# EAGLE design CanBus20mar (EAGLE 7.6.0)
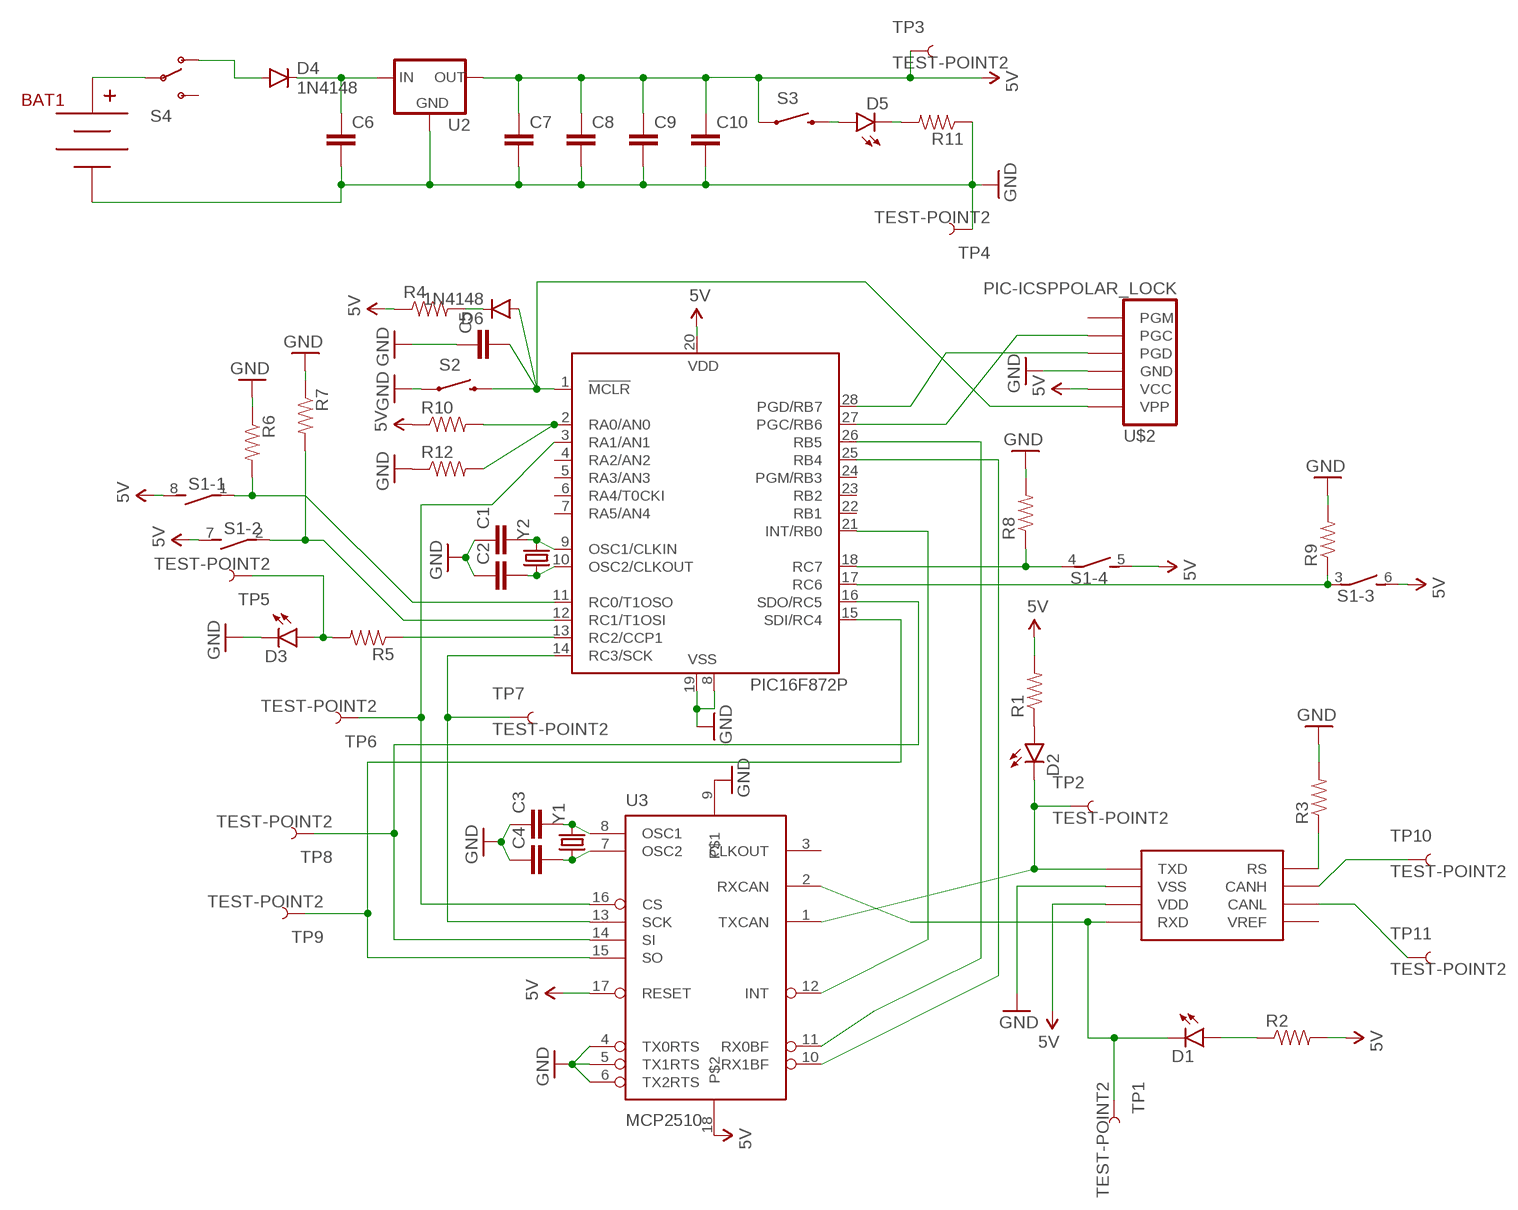
[diagram p0: schematic, sheet 1]

## Parts
BAT1  BC9VPC  [BC9VPC]
C1  CAPPTH  [CAP-PTH-SMALL]
C2  CAPPTH  [CAP-PTH-SMALL]
C3  CAPPTH  [CAP-PTH-SMALL]
C4  CAPPTH  [CAP-PTH-SMALL]
C5  CAPPTH  [CAP-PTH-SMALL]
C6  CAPPTH  [CAP-PTH-SMALL]
C7  CAPPTH  [CAP-PTH-SMALL]
C8  CAPPTH  [CAP-PTH-SMALL]
C9  CAPPTH  [CAP-PTH-SMALL]
C10  CAPPTH  [CAP-PTH-SMALL]
D1  LED5MM  [LED5MM]
D2  LED5MM  [LED5MM]
D3  LED5MM  [LED5MM]
D4  1N4148  DIODEKIT  [DIODE-1N4148-KIT]
D5  LED5MM  [LED5MM]
D6  1N4148  DIODEKIT  [DIODE-1N4148-KIT]
IC1  PIC16F872P  [DIL28-3]
R1  RESISTOREZ  [AXIAL-0.3EZ]
R2  RESISTOREZ  [AXIAL-0.3EZ]
R3  RESISTOREZ  [AXIAL-0.3EZ]
R4  RESISTOREZ  [AXIAL-0.3EZ]
R5  RESISTOREZ  [AXIAL-0.3EZ]
R6  RESISTOREZ  [AXIAL-0.3EZ]
R7  RESISTOREZ  [AXIAL-0.3EZ]
R8  RESISTOREZ  [AXIAL-0.3EZ]
R9  RESISTOREZ  [AXIAL-0.3EZ]
R10  RESISTOREZ  [AXIAL-0.3EZ]
R11  RESISTOREZ  [AXIAL-0.3EZ]
R12  RESISTORAXIAL-0.3  [AXIAL-0.3]
S1  DIP04S  [DIP04S]
S2  SWITCH-MOMENTARY-2PTH  [TACTILE-PTH]
S3  SWITCH-MOMENTARY-2PTH  [TACTILE-PTH]
S4  SWITCH-SPDTSMD2  [SWITCH-SPDT-SMD]
TP1  TEST-POINT2  [PAD.02X.02]
TP2  TEST-POINT2  [PAD.02X.02]
TP3  TEST-POINT2  [PAD.02X.02]
TP4  TEST-POINT2  [PAD.02X.02]
TP5  TEST-POINT2  [PAD.02X.02]
TP6  TEST-POINT2  [PAD.02X.02]
TP7  TEST-POINT2  [PAD.02X.02]
TP8  TEST-POINT2  [PAD.02X.02]
TP9  TEST-POINT2  [PAD.02X.02]
TP10  TEST-POINT2  [PAD.02X.02]
TP11  TEST-POINT2  [PAD.02X.02]
U2  V_REG_78XXSIDE  [78XXL]
U3  MCP2510  [DIL18]
U$1  MCP2551  [MCP2551]
U$2  PIC-ICSPPOLAR_LOCK  [MOLEX-1X6_LOCK]
Y1  CRYSTALHC49UV  [HC49U-V]
Y2  CRYSTALHC49UV  [HC49U-V]

## Nets
5V: C7.1 C8.1 C9.1 C10.1 IC1.20(VDD) R1.P$2 R2.P$2 R4.P$1 R10.P$1 S1.5 S1.6 S1.7 S1.8 S3.1 TP3.P$1 U2.OUT U3.17(RESET) U3.18 U$1.VDD U$2.5(VCC)
GND: BAT1.V- C1.1 C2.1 C3.1 C4.1 C5.1 C6.2 C7.2 C8.2 C9.2 C10.2 D3.K(C) IC1.8(VSS) IC1.19(VSS) R3.P$2 R6.P$1 R7.P$1 R8.P$2 R9.P$2 R11.P$1 R12.P$1 S2.1 TP4.P$1 U2.GND U3.4(TX0RTS) U3.5(TX1RTS) U3.6(TX2RTS) U3.9 U$1.VSS U$2.4(GND)
N$1: D1.K(C) TP1.P$1 U3.2(RXCAN) U$1.RXD
N$2: D2.K(C) TP2.P$1 U3.1(TXCAN) U$1.TXD
N$3: D2.A R1.P$1
N$4: D1.A R2.P$1
N$5: IC1.21(INT/RB0) U3.12(INT)
N$6: IC1.26(RB5) U3.11(RX0BF)
N$7: IC1.25(RB4) U3.10(RX1BF)
N$8: IC1.11(RC0/T1OSO) R6.P$2 S1.1
N$9: R3.P$1 U$1.RS
N$10: IC1.2(RA0/AN0) R10.P$2 R12.P$2
N$11: C3.2 U3.8(OSC1) Y1.2
N$12: C4.2 U3.7(OSC2) Y1.1
N$13: C1.2 IC1.9(OSC1/CLKIN) Y2.2
N$14: C2.2 IC1.10(OSC2/CLKOUT) Y2.1
N$15: IC1.14(RC3/SCK) TP7.P$1 U3.13(SCK)
N$16: IC1.16(SDO/RC5) TP8.P$1 U3.14(SI)
N$17: IC1.15(SDI/RC4) TP9.P$1 U3.15(SO)
N$18: IC1.3(RA1/AN1) TP6.P$1 U3.16(CS)
N$19: C5.2 D6.A IC1.1(!MCLR!) S2.3 U$2.6(VPP)
N$20: IC1.13(RC2/CCP1) R5.P$1
N$21: D3.A R5.P$2 TP5.P$1
N$22: IC1.27(PGC/RB6) U$2.2(PGC)
N$23: IC1.12(RC1/T1OSI) R7.P$2 S1.2
N$24: IC1.17(RC6) R9.P$1 S1.3
N$25: IC1.18(RC7) R8.P$1 S1.4
N$26: BAT1.V+ S4.2(P)
N$27: C6.1 D4.C U2.IN
N$28: D5.K(C) R11.P$2
N$29: D4.A S4.1(O)
N$30: D5.A S3.3
N$31: TP11.P$1 U$1.CANL
N$32: TP10.P$1 U$1.CANH
N$33: IC1.28(PGD/RB7) U$2.3(PGD)
N$34: D6.C R4.P$2
Unconnected: IC1.4(RA2/AN2) IC1.5(RA3/AN3) IC1.6(RA4/T0CKI) IC1.7(RA5/AN4) IC1.22(RB1) IC1.23(RB2) IC1.24(PGM/RB3) S4.3(S) U3.3(CLKOUT) U$1.VREF U$2.1(PGM)

## Library data of the parts
BAT1 = SparkFun-Connectors:BC9VPC: 9V board-mount battery cradle; PROD_ID: BATT-10855
C1-C10 = SparkFun-Passives:CAP: Capacitor Standard 0603 ceramic capacitor, and 0.1" leaded capacitor.
D1-D3 D5 = SparkFun-LED:LED: LEDs Standard schematic elements and footprints for 5mm, 3mm, 1206, and 0603 sized LEDs. 5mm - Spark Fun Electronics SKU : COM-00529 (and others)
D4 D6 = SparkFun-DiscreteSemi:DIODE: Diode These are standard reverse protection diodes and small signal diodes. SMA package can handle up to about 1A. SOD-323 can handle about 200mA. What the SOD-323 package when ordering, there are some mfgs out there that are 5-pin packages.
IC1 = microchip:PIC16*872: MICROCONTROLLER flash type; MF: MICROCHIP; MPN: PIC16F872-I/SP; OC_FARNELL: 9761012; OC_NEWARK: 12C1945
R1-R11 = SparkFun-Passives:RESISTOR: Resistor Basic schematic elements and footprints for 0603, 1206, and PTH resistors.
R12 = SparkFun-Resistors:RESISTOR: Resistor Basic schematic elements and footprints for 0603, 1206, and PTH resistors.
S1 = switch-dil:DIP04S: DIL/CODE SWITCH; OC_FARNELL: unknown; OC_NEWARK: unknown
S2 S3 = SparkFun-Electromechanical:SWITCH-MOMENTARY-2: Various NO switches- pushbuttons, reed, etc; PROD_ID: SWCH-08441
S4 = SparkFun-Electromechanical:SWITCH-SPDT: SPDT Switch Simple slide switch, Spark Fun Electronics SKU : COM-00102 DPDT SMT slide switch, AYZ0202, SWCH-08179
TP1-TP11 = SparkFun-Passives:TEST-POINT: Bare copper test points for troubleshooting or ICT
U2 = SparkFun-PowerIC:V_REG_78XX: Voltage Regulator Standard 78xx regulator. IGO (Input Ground Output). Spark Fun Electronics SKU : COM-00107
U3 = SparkFun-DigitalICfixed:MCP2510: CAN controller with SPI interface to any MCU. Original design by Microchip.
U$1 = mylibrary:MCP2551
U$2 = SparkFun-Connectors:PIC-ICSP: ISCP Programming connector for UAV, UBW Kit, etc.
Y1 Y2 = SparkFun-FreqCtrl:CRYSTAL: Various standard crystals. Proven footprints.

## Board
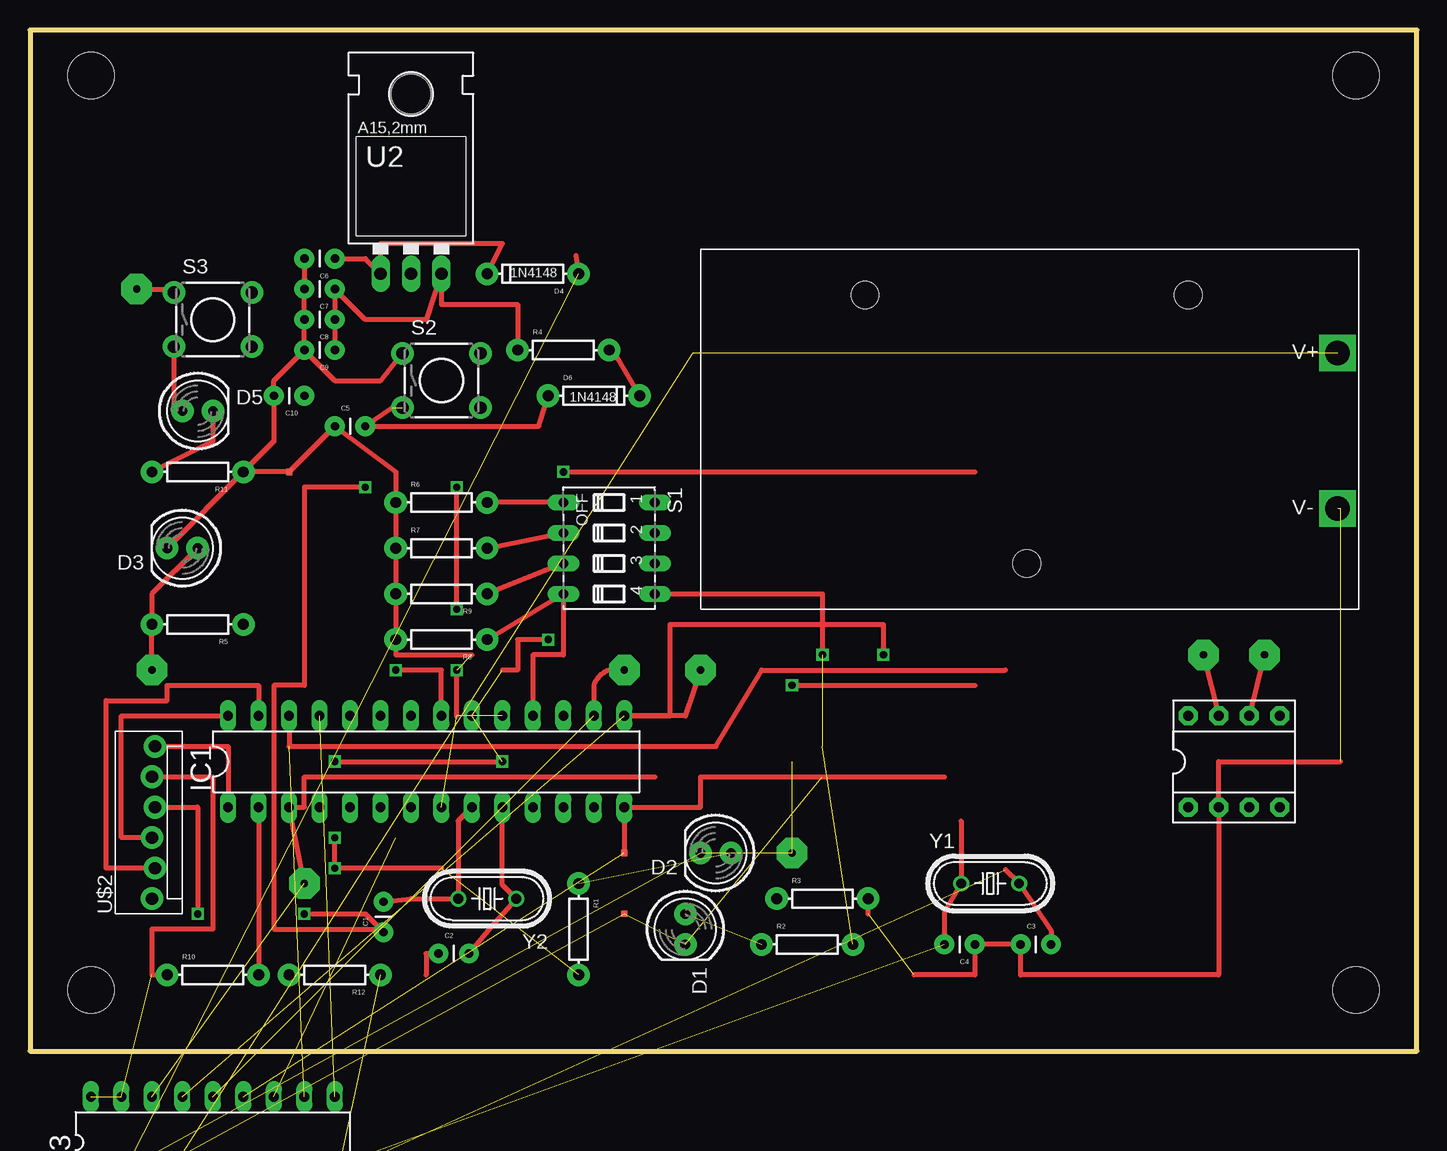
[diagram p1: board, top side]
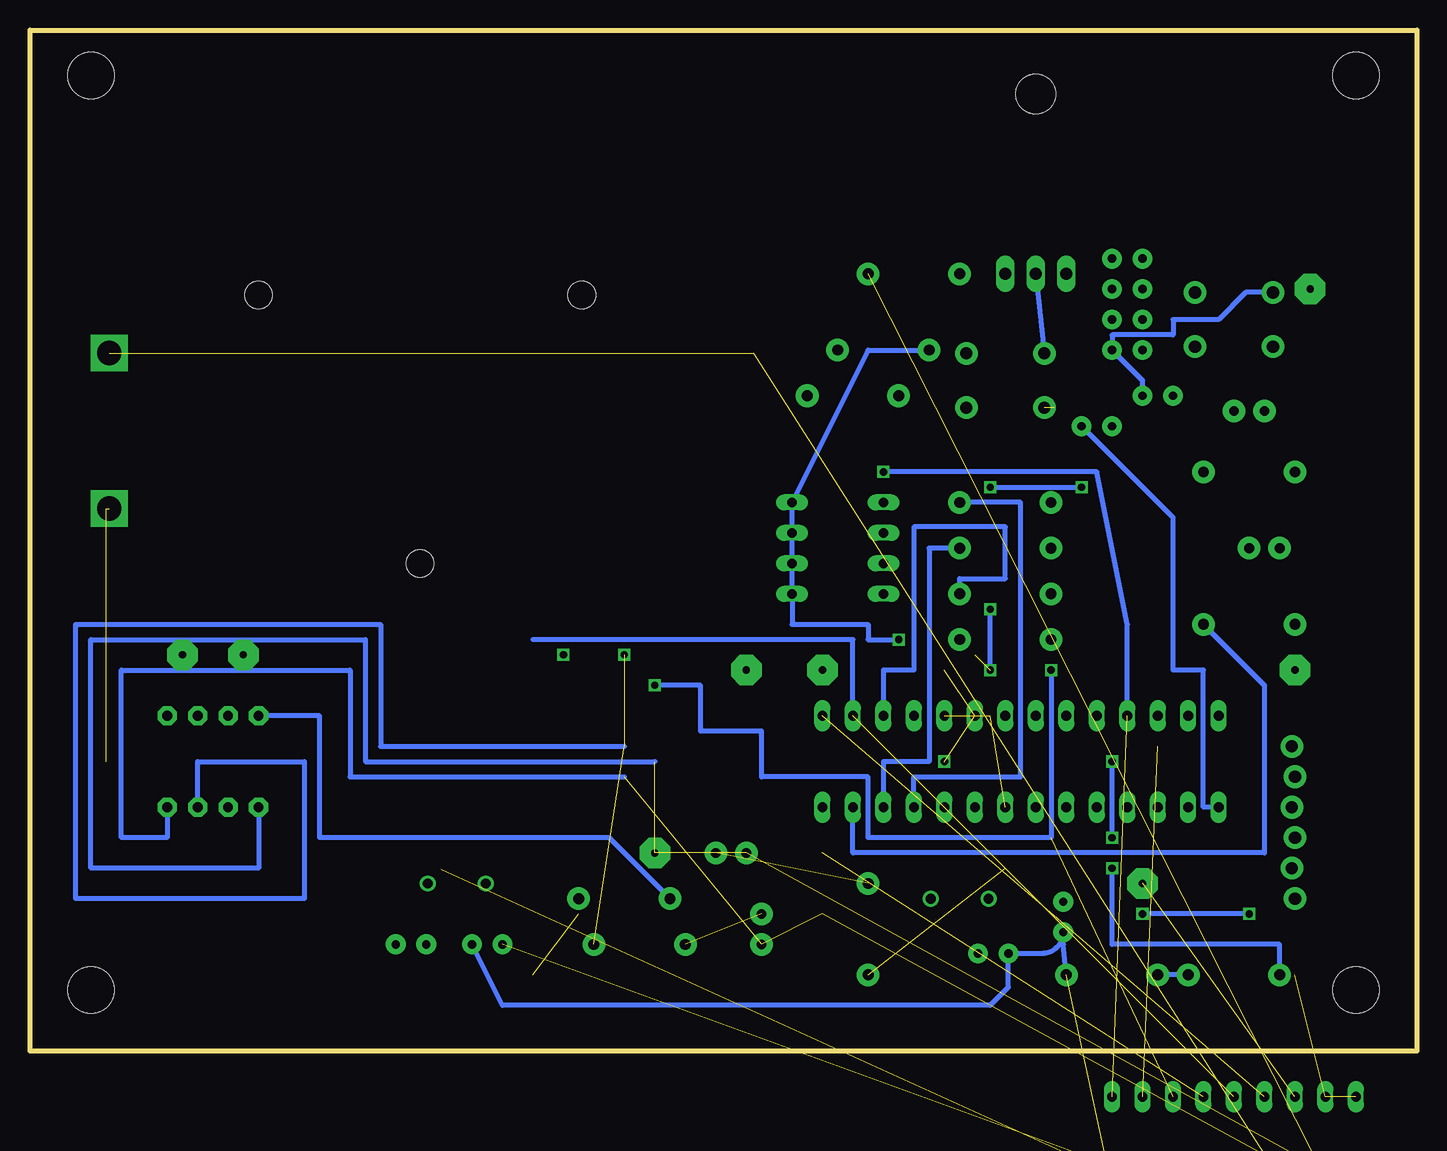
[diagram p2: board, bottom side, seen from below]

Size 115.57 x 85.09 mm. Coordinates in mm from the lower left corner, seen from the top.
Outline: 0,0 115.57,0 115.57,85.09 0,85.09 0,0
Copper layers (1*16): Top 0.035mm / dielectric 1.5mm / Bottom 0.035mm
Design rules "default": minimum track width 10mil, minimum drill 24mil, track to track 8mil, track to pad 8mil, pad to pad 8mil, via to via 8mil, smd to smd 8mil, copper to edge 40mil, drill to drill 8mil, minimum pad ring 10mil, minimum via ring 8mil, stop-mask expansion 4mil, vias tented up to drill 0mil, thermal gap 10mil
Holes 3.86 mm at 5.08,5.08 110.49,5.08 110.49,81.28 5.08,81.28

### Footprints (pad centres in the part's own frame; a part is rotated, then mirrored left to right if it is on the bottom)
BC9VPC = drill 2.032 square: V+ 53.086,21.336; V- 53.086,8.382 | hole 2.286: 27.178,3.81; 13.716,26.162; 40.64,26.162
CAP-PTH-SMALL = drill 0.7 pad 1.651: 1 0,0; 2 2.54,0
LED5MM = drill 0.813 pad 1.88: A -1.27,0; K 1.27,0
DIODE-1N4148-KIT = drill 0.9 pad 1.88: A -3.81,0; C 3.81,0
DIL28-3 = drill 0.813 long: 1 -16.51,-3.81; 2 -13.97,-3.81; 3 -11.43,-3.81; 4 -8.89,-3.81; 5 -6.35,-3.81; 6 -3.81,-3.81; 7 -1.27,-3.81; 8 1.27,-3.81; 9 3.81,-3.81; 10 6.35,-3.81; 11 8.89,-3.81; 12 11.43,-3.81; 13 13.97,-3.81; 14 16.51,-3.81; 15 16.51,3.81; 16 13.97,3.81; 17 11.43,3.81; 18 8.89,3.81; 19 6.35,3.81; 20 3.81,3.81; 21 1.27,3.81; 22 -1.27,3.81; 23 -3.81,3.81; 24 -6.35,3.81; 25 -8.89,3.81; 26 -11.43,3.81; 27 -13.97,3.81; 28 -16.51,3.81
AXIAL-0.3EZ = drill 0.9 pad 1.88: P$1 -3.81,0; P$2 3.81,0
AXIAL-0.3 = drill 0.9 pad 1.88: P$1 -3.81,0; P$2 3.81,0
DIP04S = drill 0.813 long: 1 -3.81,-3.81; 2 -1.27,-3.81; 3 1.27,-3.81; 4 3.81,-3.81; 5 3.81,3.81; 6 1.27,3.81; 7 -1.27,3.81; 8 -3.81,3.81
TACTILE-PTH = drill 1.016 pad 1.88: 1 -3.251,2.261; 2 3.251,2.261; 3 -3.251,-2.261; 4 3.251,-2.261
SWITCH-SPDT-SMD = smd 1.2 x 2.5: 1 -2.5,-2.75; 2 0,-2.75; 3 2.5,-2.75 | hole 0.9: -3.55,0; 3.55,0
PAD.02X.02 = smd 0.508 x 0.508: P$1 0,0
78XXL = drill 1.016 long: GND 0,-3.81; IN -2.54,-3.81; OUT 2.54,-3.81 | hole 3.302: 0,11.176
DIL18 = drill 0.813 long: 1 -10.16,-3.81; 2 -7.62,-3.81; 3 -5.08,-3.81; 4 -2.54,-3.81; 5 0,-3.81; 6 2.54,-3.81; 7 5.08,-3.81; 8 7.62,-3.81; 9 10.16,-3.81; 10 10.16,3.81; 11 7.62,3.81; 12 5.08,3.81; 13 2.54,3.81; 14 0,3.81; 15 -2.54,3.81; 16 -5.08,3.81; 17 -7.62,3.81; 18 -10.16,3.81
MCP2551 = drill 0.813 pad 1.6 octagon: CANH -1.27,3.81; CANL 1.27,3.81; RS -3.81,3.81; RXD 3.81,-3.81; TXD -3.81,-3.81; VDD 1.27,-3.81; VREF 3.81,3.81; VSS -1.27,-3.81
MOLEX-1X6_LOCK = drill 1.016 pad 1.88: 1 0,0; 2 2.54,-0.254; 3 5.08,0; 4 7.62,-0.254; 5 10.16,0; 6 12.7,-0.254
HC49U-V = drill 0.813: 1 -2.413,0; 2 2.413,0

### Placement (x,y rotation side)
BAT1  55.88,36.83 0 top
C1  29.46,9.91 90 top
C2  34.04,8.13 0 top
C3  82.55,8.89 0 top
C4  78.74,8.89 180 top
C5  25.4,52.07 0 top
C6  25.4,66.04 180 top
C7  25.4,63.5 180 top
C8  25.4,60.96 180 top
C9  25.4,58.42 180 top
C10  22.86,54.61 180 top
D1  54.61,10.16 270 top
D2  57.15,16.51 180 top
D3  12.7,41.91 180 top
D4  41.91,64.77 180 top
D5  13.97,53.34 0 top
D6  46.99,54.61 0 top
IC1  33.02,24.13 0 top
R1  45.72,10.16 270 top
R2  64.77,8.89 0 top
R3  66.04,12.7 0 top
R4  44.45,58.42 0 top
R5  13.97,35.56 180 top
R6  34.29,45.72 0 top
R7  34.29,41.91 0 top
R8  34.29,34.29 180 top
R9  34.29,38.1 180 top
R10  15.24,6.35 0 top
R11  13.97,48.26 180 top
R12  25.4,6.35 180 top
S1  48.26,41.91 270 top
S2  34.29,55.88 0 top
S3  15.24,60.96 0 top
S4  5.08,-17.78 0 top  (outside the outline)
TP1  49.53,11.43 90 top
TP2  63.5,16.51 0 top
TP3  8.89,63.5 0 top
TP4  21.59,48.26 0 top
TP5  10.16,31.75 0 top
TP6  22.86,13.97 0 top
TP7  49.53,16.51 0 top
TP8  49.53,31.75 0 top
TP9  55.88,31.75 180 top
TP10  97.79,33.02 0 top
TP11  102.87,33.02 0 top
U2  31.75,68.58 0 top
U3  15.24,-7.62 0 top  (outside the outline)
U$1  100.33,24.13 0 top
U$2  10.16,12.7 90 top
Y1  80.01,13.97 0 top
Y2  38.1,12.7 180 top

### Tracks (layer width: path | path; a pad name or v marks a point on that pad's centre or on a via)
5V  (via drill 0.6, 0.6 pad 2.54)  (7 unrouted)
  Top 0.406: C9.1 C8.1 C7.1 27.94,60.96 33.02,60.96 U2.OUT 34.29,62.23 40.64,62.23 R4.P$1 | TP3.P$1 11.71,63.5 S3.1 | S1.5 66.04,38.1 v66.04,33.02 | v43.18,34.29 40.64,34.29 40.64,31.75 39.37,31.75 | 34.29,15.24 v25.4,15.24 v25.4,17.78 | v25.4,24.13 v39.37,24.13 | U$2.5 15.24,22.86 15.24,10.16 10.16,10.16 10.16,6.35 R10.P$1
  Bottom 0.406: C10.1 22.86,55.88 C9.1 25.4,59.69 20.32,59.69 20.32,60.96 16.51,60.96 14.25,63.22 S3.1 | R4.P$1 45.72,58.42 S1.8 S1.7 S1.6 S1.5 52.07,35.56 45.72,35.56 45.72,34.29 v43.18,34.29 | U$1.VDD 101.6,24.13 92.71,24.13 92.71,12.7 111.76,12.7 111.76,35.56 86.36,35.56 86.36,25.4 66.04,25.4 | v25.4,15.24 25.4,8.89 11.43,8.89 R10.P$1 | v25.4,17.78 v25.4,24.13
  other vias: 8.89,63.5
GND  (via drill 0.6)  (10 unrouted)
  Top 0.406: C6.2 C7.2 C8.2 C9.2 | C9.2 20.32,55.88 C10.2 20.32,50.8 R11.P$1 | R11.P$1 TP4.P$1 C5.1 30.48,48.26 R6.P$1 R7.P$1 R9.P$2 R8.P$2 30.48,33.02 36.83,33.02 | R11.P$1 D3.K | 109.22,24.13 99.06,24.13 U$1.VSS 99.06,6.35 82.55,6.35 C3.1 C4.1 78.74,6.35 73.66,6.35 | 69.85,11.43 R3.P$2 | C2.1 33.02,8.13 33.02,6.35 | 35.56,27.94 v35.56,31.75 | v35.56,36.83 v35.56,46.99 | v27.94,46.99 22.86,46.99 22.86,30.48 20.32,30.48 20.32,10.16 29.46,10.16 C1.1 27.94,11.43 v22.86,11.43 | U$2.4 13.97,20.32 v13.97,11.43 | C9.2 25.4,55.88 29.21,55.88 S2.1
  Bottom 0.406: C4.1 76.2,3.81 35.56,3.81 34.04,5.33 C2.1 31.24,8.13 arc-90 C1.1 | v35.56,31.75 v35.56,36.83 | v35.56,46.99 v27.94,46.99 | 29.46,10.16 C1.1 | R12.P$1 29.46,8.89 C1.1 | v13.97,11.43 v22.86,11.43 | U2.GND S2.1
N$1  (3 unrouted)
  Bottom 0.406: U$1.RXD 104.14,17.78 107.95,17.78 107.95,31.75 88.9,31.75 88.9,22.86 66.04,22.86
N$2  (via drill 0.6 pad 2.54)  (3 unrouted)
  Bottom 0.406: U$1.TXD 96.52,15.24 110.49,15.24 110.49,34.29 87.63,34.29 87.63,24.13 63.5,24.13
  other vias: 63.5,16.51
N$3  (1 unrouted)
N$4  (1 unrouted)
N$5  (via drill 0.6)  (1 unrouted)
  Top 0.406: IC1.21 34.29,31.75 v30.48,31.75 | v63.5,30.48 78.74,30.48
  Bottom 0.406: v30.48,31.75 30.48,17.78 45.72,17.78 45.72,22.86 54.61,22.86 54.61,26.67 59.69,26.67 59.69,30.48 v63.5,30.48
N$6  (1 unrouted)
  Top 0.406: IC1.26 21.59,25.4 57.15,25.4 60.96,31.75 81.28,31.75
N$7  (via drill 0.6)  (1 unrouted)
  Top 0.406: v44.45,48.26 78.74,48.26
  Bottom 0.406: IC1.25 24.13,35.56 26.67,48.26 v44.45,48.26
N$8
  Top 0.406: S1.1 R6.P$2
  Bottom 0.406: IC1.11 41.91,22.86 33.02,22.86 33.02,45.72 R6.P$2
N$9
  Bottom 0.406: R3.P$1 67.31,17.78 91.44,17.78 91.44,27.94 U$1.RS
N$10
  Top 0.406: IC1.2 R10.P$2
  Bottom 0.406: R10.P$2 R12.P$2
N$11  (1 unrouted)
  Top 0.406: 81.28,15.11 Y1.2 85.09,10.03 C3.2
N$12  (1 unrouted)
  Top 0.406: 77.6,19.18 Y1.1 76.2,11.56 C4.2
N$13
  Top 0.406: C1.2 31.75,12.7 Y2.2 35.69,19.18 IC1.9
N$14
  Top 0.406: IC1.10 39.37,13.84 Y2.1 38.35,10.29 C2.2
N$15  (1 unrouted)
  Top 0.406: TP7.P$1 IC1.14 55.88,20.32 55.88,22.86 76.2,22.86
N$16  (1 unrouted)
  Top 0.406: TP8.P$1 arc90 46.99,30.48 IC1.16
  Bottom 0.406: IC1.16 46.99,34.29 73.66,34.29
N$17  (via drill 0.6)  (1 unrouted)
  Top 0.406: TP9.P$1 54.61,27.94 IC1.15 53.34,27.94 53.34,35.56 71.12,35.56 v71.12,33.02
N$18  (1 unrouted)
  Top 0.406: TP6.P$1 IC1.3 22.86,20.32 22.86,22.86 52.07,22.86
N$19  (1 unrouted)
  Top 0.406: 30.2,53.62 C5.2 42.4,52.07 D6.A | U$2.6 16.51,25.4 IC1.1
  Bottom 0.406: IC1.1 17.78,20.32 17.78,31.75 20.32,31.75 20.32,44.45 C5.2
N$20
  Bottom 0.406: R5.P$1 12.7,30.48 12.7,16.51 46.99,16.51 IC1.13
N$21  (via drill 0.6 pad 2.54)
  Top 0.406: D3.A 10.16,38.1 R5.P$2 TP5.P$1
  other vias: 10.16,31.75
N$22
  Top 0.406: U$2.2 6.35,15.24 6.35,29.21 11.43,29.21 11.43,30.48 19.05,30.48 IC1.27
N$23
  Top 0.406: R7.P$2 S1.2
  Bottom 0.406: R7.P$2 40.64,41.91 40.64,24.13 44.45,24.13 IC1.12
N$24
  Top 0.406: S1.3 R9.P$1
  Bottom 0.406: R9.P$1 38.1,39.37 34.29,39.37 34.29,43.69 41.91,43.69 41.91,31.75 44.45,31.75 IC1.17
N$25
  Top 0.406: R8.P$1 S1.4 44.45,33.02 41.91,33.02 IC1.18
N$26  (2 unrouted)
N$27
  Top 0.406: C6.1 27.94,66.04 U2.IN 29.21,67.31 39.37,67.31 D4.C
N$28
  Top 0.406: D5.K 15.24,50.8 R11.P$2
N$29  (1 unrouted)
  Top 0.406: 45.48,66.29 D4.A
N$30
  Top 0.406: S3.3 11.99,54.05 D5.A
N$31  (via drill 0.6 pad 2.54)
  Top 0.406: TP11.P$1 U$1.CANL
  other vias: 102.87,33.02
N$32
  Top 0.406: TP10.P$1 U$1.CANH
N$33
  Top 0.406: U$2.3 7.62,17.78 7.62,27.94 IC1.28
N$34
  Top 0.406: D6.C 49.04,57.64 R4.P$2
N$35  (via drill 0.6 pad 2.54)
  other vias: 22.86,13.97
N$36  (via drill 0.6 pad 2.54)
  other vias: 97.79,33.02
N$37  (via drill 0.6 pad 2.54)
  other vias: 55.88,31.75
N$38  (via drill 0.6 pad 2.54)
  other vias: 49.53,31.75